# Altium project RS422.PrjPcb
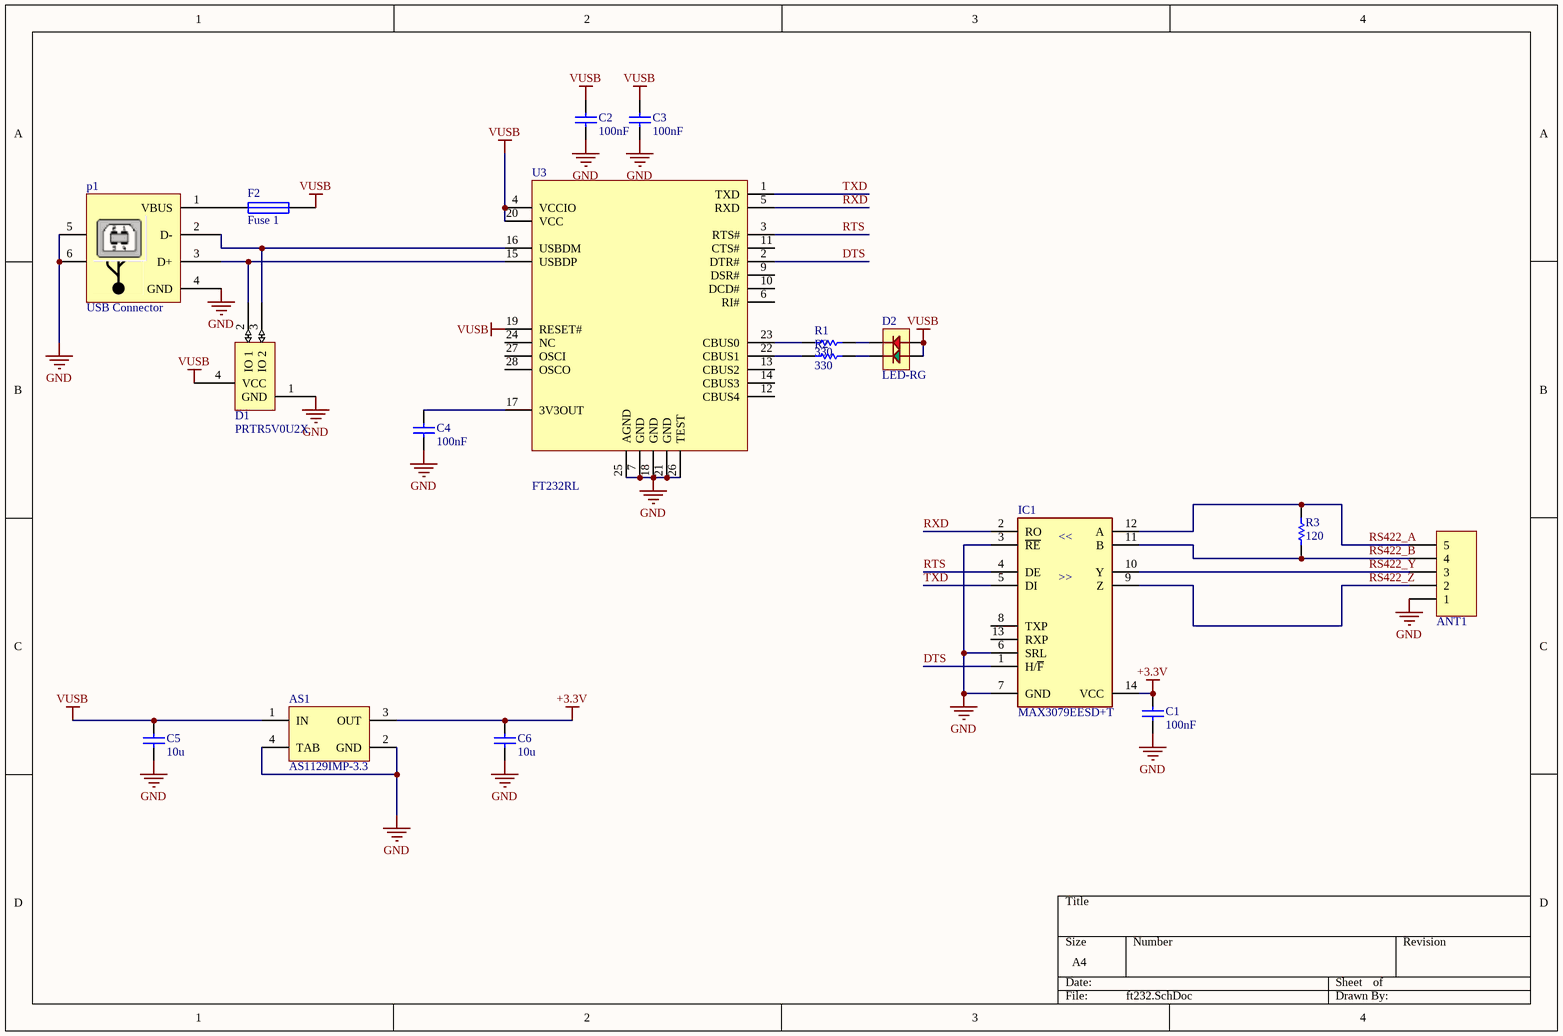
[diagram p0: ft232.SchDoc]
1 sheet, 17 parts. Net scope: global (net labels, ports and power ports of the same name join across sheets).
Board file: MAIN.PcbDoc

## Sheet ft232.SchDoc
size A4; SheetNumber: 2; SheetTotal: 7

### Parts
ANT1  CONN-5  [PH-5]  (value not drawn)
AS1  AS1129IMP-3.3  [SOT-223]
C1  100nF  [C603]
C2  100nF  [c603]
C3  100nF  [c603]
C4  100nF  [c603]
C5  10u  [C603]
C6  10u  [C603]
D1  PRTR5V0U2X  [SOT-143B]
D2  LED-RG  [LED-1210]
F2  Fuse 1  [PTC-0805]
IC1  MAX3079EESD+T  [SOIC127P600X175-14N]
p1  USB Connector  [USB2-B-R]
R1  330  [R0603]
R2  330  [R0603]
R3  120  [R0603]
U3  FT232RL  [SSOP-28N]

### Nets
+3.3V: AS1.3(OUT) C1.2 C6.2 IC1.14(VCC)
GND: ANT1.1 AS1.2(GND) AS1.4(TAB) C1.1 C2.1 C3.1 C4.1 C5.1 C6.1 D1.1(GND) IC1.3(~{RE}) IC1.6(SRL) IC1.7(GND) p1.4(GND) p1.5 p1.6 U3.7(GND) U3.18(GND) U3.21(GND) U3.25(AGND) U3.26(TEST)
VUSB: AS1.1(IN) C2.2 C3.2 C5.2 D1.4(VCC) D2.1(GRN-A) D2.2(RED-A) F2.2 U3.4(VCCIO) U3.19(RESET#) U3.20(VCC)
DTS: IC1.1(H/~{F}) U3.2(DTR#)
RS422_A: ANT1.5 IC1.12(A) R3.2
RS422_B: ANT1.4 IC1.11(B) R3.1
RS422_Y: ANT1.3 IC1.10(Y)
RS422_Z: ANT1.2 IC1.9(Z)
RTS: IC1.4(DE) U3.3(RTS#)
RXD: IC1.2(RO) U3.5(RXD)
TXD: IC1.5(DI) U3.1(TXD)
NetC4_2: C4.2 U3.17(3V3OUT)
NetD1_2: D1.2(IO_1) p1.3(D+) U3.15(USBDP)
NetD1_3: D1.3(IO_2) p1.2(D-) U3.16(USBDM)
NetD2_3: D2.3(RED-C) R1.2
NetD2_4: D2.4(GRN-C) R2.2
NetF2_1: F2.1 p1.1(VBUS)
NetR1_1: R1.1 U3.23(CBUS0)
NetR2_1: R2.1 U3.22(CBUS1)

Not connected (* = marked no-connect by the designer): IC1 8(TXP) 13(RXP); U3 6(RI#) 8(NC) 9(DSR#) 10(DCD#) 11(CTS#) 12(CBUS4) 13(CBUS2) 14(CBUS3) 24(NC) 27(OSCI) 28(OSCO)

### Notes on the sheet
- (in symbol MAX3079EESD+T) <<; >>

### Library data of the parts
AS1 = AS1129IMP-x.x: x.x Volt, 800mA Low-Dropout Linear Regulator, 4-pin SOT-223; PartNumber: LM1117IMP-3.3; Manufacturer: National Semiconductor; PackageTopMarking: XYTT*N05B; PowerWise: N; CompType: LDO IC; Published: 4-Dec-2008; DatasheetVersion: Apr-2006; PackageVersion: revB, Apr-2003; PackageReference: MP04A; Publisher: Altium Limited; PackageDescription: Molded SOT-223, 6.50 x 3.56 x 1.6mm Body, 4 Lead, 2.3mm Pitch; Supplier 1: Farnell; Supplier Part Number 1: 7614123; RoHS: N; PinCount: 4; Code_JEDEC: TO-261-AA; Code_IPC: SOT223-4; ComponentLink1Description: LM1117 Datasheet; ComponentLink1URL: http://www.national.com/ds/LM/LM1117.pdf; ComponentLink2Description: LM1117 Web Page; ComponentLink2URL: http://www.national.com/pf/LM/LM1117.html; ComponentLink3Description: MP04A Package Page; ComponentLink3URL: http://www.national.com/packaging/folders/mp04a.html
C1-C6 = Cap: Capacitor; Designer: Parsa Malekpour
  C1-C4: Value: 100nF
  C5 C6: Value: 10u
D1 = PRTR5V0U2X: Ultra low capacitance double rail-to-rail ESD protection diode; reverse standoff voltage: 5.5V
D2 = LED-RG-4
F2 = Fuse 1: Fuse; Published: 8-Jun-2000; LatestRevisionDate: 17-Jul-2002; LatestRevisionNote: Re-released for DXP Platform.; PackageReference: PIN-W2/E2.8; Publisher: Altium Limited; PackageDescription: Thru-Hole; 2 Leads
IC1 = MAX3079EESD+T: Integrated Circuit; Manufacturer_Name: Analog Devices; Datasheet Link: https://datasheets.maximintegrated.com/en/ds/MAX3070E-MAX3079E.pdf; Height: 1.75mm; Manufacturer_Part_Number: MAX3079EESD+T; Mouser Part Number: 700-MAX3079EESDT; Mouser Price/Stock: https://www.mouser.co.uk/ProductDetail/Analog-Devices-Maxim-Integrated/MAX3079EESD%2bT?qs=CDqwynd4ZNoEpjqZ6oN2%252BA%3D%3D; Arrow Part Number: MAX3079EESD+T; Arrow Price/Stock: https://www.arrow.com/en/products/max3079eesdt/analog-devices?region=nac
p1 = USB2-B: USB Connector-B Type; Designer: Eng. Saeid Jorablo; Company: DASE Co; Adding Date: 10/26/2010
R1-R3 = Resistor: Designer: Parsa Malekpour
  R1 R2: Value: 330
  R3: Value: 120